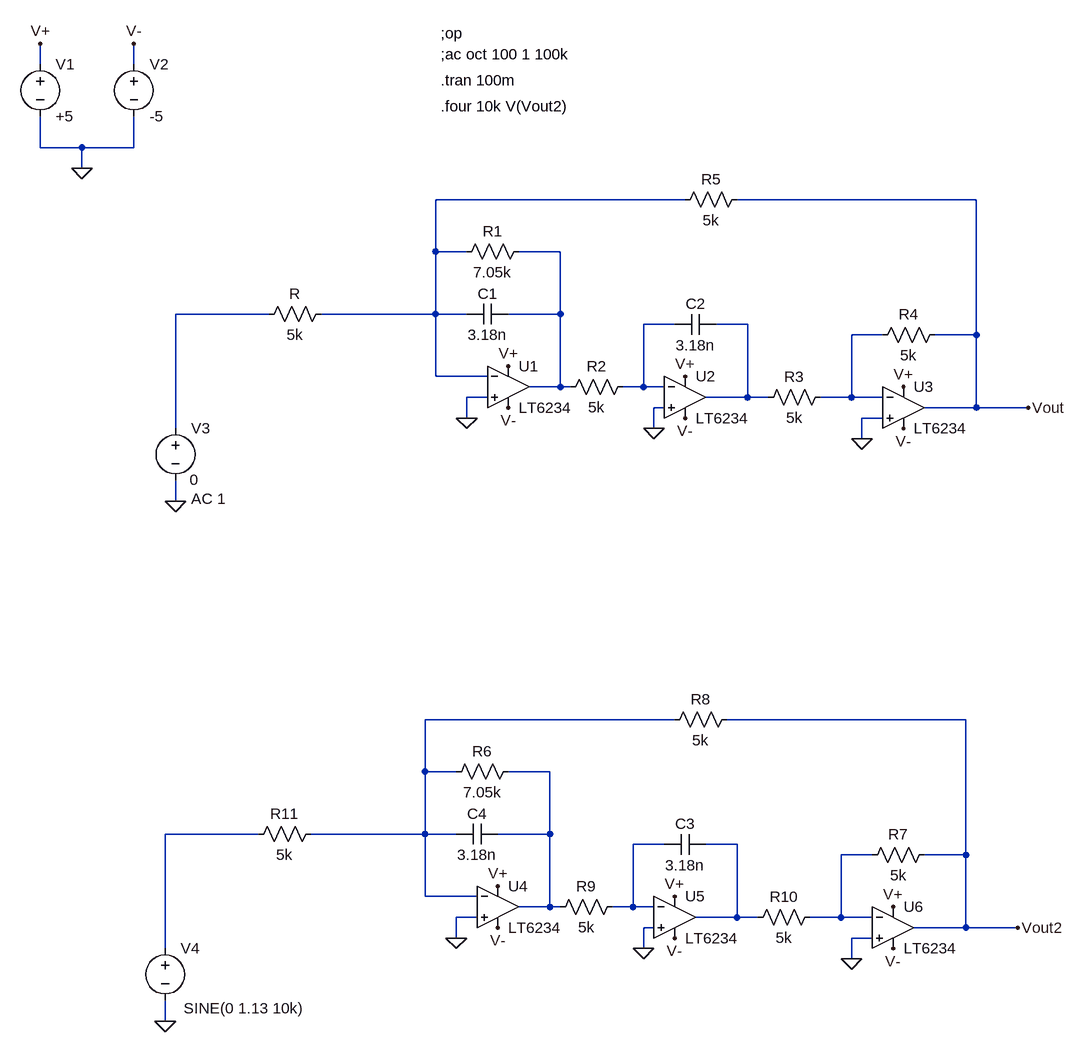
[diagram p0: schematic ETAJUL2_TOW_THOMAS.asc]
ETAJUL2_TOW_THOMAS.asc, the LTspice schematic file:
Version 4
SHEET 1 952 1140
WIRE -640 -352 -640 -384
WIRE -496 -352 -496 -384
WIRE -640 -224 -640 -272
WIRE -576 -224 -640 -224
WIRE -496 -224 -496 -272
WIRE -496 -224 -576 -224
WIRE -576 -192 -576 -224
WIRE 352 -144 -32 -144
WIRE 800 -144 432 -144
WIRE -32 -64 -32 -144
WIRE 16 -64 -32 -64
WIRE 160 -64 96 -64
WIRE -288 32 -432 32
WIRE -32 32 -32 -64
WIRE -32 32 -208 32
WIRE 16 32 -32 32
WIRE 160 32 160 -64
WIRE 160 32 80 32
WIRE 336 48 288 48
WIRE 448 48 400 48
WIRE 656 64 608 64
WIRE 800 64 800 -144
WIRE 800 64 736 64
WIRE -32 128 -32 32
WIRE 48 128 -32 128
WIRE 160 144 160 32
WIRE 160 144 112 144
WIRE 176 144 160 144
WIRE 288 144 288 48
WIRE 288 144 256 144
WIRE 320 144 288 144
WIRE 48 160 16 160
WIRE 448 160 448 48
WIRE 448 160 384 160
WIRE 480 160 448 160
WIRE 608 160 608 64
WIRE 608 160 560 160
WIRE 656 160 608 160
WIRE 320 176 304 176
WIRE 800 176 800 64
WIRE 800 176 720 176
WIRE 880 176 800 176
WIRE 16 192 16 160
WIRE 656 192 624 192
WIRE -432 208 -432 32
WIRE 304 208 304 176
WIRE 624 224 624 192
WIRE -432 320 -432 288
WIRE 336 656 -48 656
WIRE 784 656 416 656
WIRE -48 736 -48 656
WIRE 0 736 -48 736
WIRE 144 736 80 736
WIRE -304 832 -448 832
WIRE -48 832 -48 736
WIRE -48 832 -224 832
WIRE 0 832 -48 832
WIRE 144 832 144 736
WIRE 144 832 64 832
WIRE 320 848 272 848
WIRE 432 848 384 848
WIRE 640 864 592 864
WIRE 784 864 784 656
WIRE 784 864 720 864
WIRE -48 928 -48 832
WIRE 32 928 -48 928
WIRE 144 944 144 832
WIRE 144 944 96 944
WIRE 160 944 144 944
WIRE 272 944 272 848
WIRE 272 944 240 944
WIRE 304 944 272 944
WIRE 32 960 0 960
WIRE 432 960 432 848
WIRE 432 960 368 960
WIRE 464 960 432 960
WIRE 592 960 592 864
WIRE 592 960 544 960
WIRE 640 960 592 960
WIRE 304 976 288 976
WIRE 784 976 784 864
WIRE 784 976 704 976
WIRE 864 976 784 976
WIRE 0 992 0 960
WIRE 640 992 608 992
WIRE -448 1008 -448 832
WIRE 288 1008 288 976
WIRE 608 1024 608 992
WIRE -448 1120 -448 1088
FLAG 16 192 0
FLAG 304 208 0
FLAG 624 224 0
FLAG -576 -192 0
FLAG -640 -384 V+
FLAG 80 112 V+
FLAG 352 128 V+
FLAG 688 144 V+
FLAG 80 176 V-
FLAG 352 192 V-
FLAG 688 208 V-
FLAG -496 -384 V-
FLAG -432 320 0
FLAG 880 176 Vout
FLAG 0 992 0
FLAG 288 1008 0
FLAG 608 1024 0
FLAG 64 912 V+
FLAG 336 928 V+
FLAG 672 944 V+
FLAG 64 976 V-
FLAG 336 992 V-
FLAG 672 1008 V-
FLAG -448 1120 0
FLAG 864 976 Vout2
DATAFLAG 848 176 ""
SYMBOL OpAmps\\LT6234 80 144 R0
SYMATTR InstName U1
SYMBOL OpAmps\\LT6234 352 160 R0
SYMATTR InstName U2
SYMBOL OpAmps\\LT6234 688 176 R0
SYMATTR InstName U3
SYMBOL cap 400 32 R90
WINDOW 0 0 32 VBottom 2
WINDOW 3 32 32 VTop 2
SYMATTR InstName C2
SYMATTR Value 3.18n
SYMBOL cap 80 16 R90
WINDOW 0 0 32 VBottom 2
WINDOW 3 32 32 VTop 2
SYMATTR InstName C1
SYMATTR Value 3.18n
SYMBOL res 112 -80 R90
WINDOW 0 0 56 VBottom 2
WINDOW 3 32 56 VTop 2
SYMATTR InstName R1
SYMATTR Value 7.05k
SYMBOL res 752 48 R90
WINDOW 0 0 56 VBottom 2
WINDOW 3 32 56 VTop 2
SYMATTR InstName R4
SYMATTR Value 5k
SYMBOL res 448 -160 R90
WINDOW 0 0 56 VBottom 2
WINDOW 3 32 56 VTop 2
SYMATTR InstName R5
SYMATTR Value 5k
SYMBOL res 272 128 R90
WINDOW 0 0 56 VBottom 2
WINDOW 3 32 56 VTop 2
SYMATTR InstName R2
SYMATTR Value 5k
SYMBOL res 576 144 R90
WINDOW 0 0 56 VBottom 2
WINDOW 3 32 56 VTop 2
SYMATTR InstName R3
SYMATTR Value 5k
SYMBOL voltage -640 -368 R0
SYMATTR InstName V1
SYMATTR Value +5
SYMBOL voltage -496 -368 R0
SYMATTR InstName V2
SYMATTR Value -5
SYMBOL voltage -432 192 R0
WINDOW 123 24 124 Left 2
WINDOW 39 0 0 Left 0
WINDOW 3 22 95 Left 2
SYMATTR Value2 AC 1
SYMATTR InstName V3
SYMATTR Value 0
SYMBOL res -192 16 R90
WINDOW 0 0 56 VBottom 2
WINDOW 3 32 56 VTop 2
SYMATTR InstName R
SYMATTR Value 5k
SYMBOL OpAmps\\LT6234 64 944 R0
SYMATTR InstName U4
SYMBOL OpAmps\\LT6234 336 960 R0
SYMATTR InstName U5
SYMBOL OpAmps\\LT6234 672 976 R0
SYMATTR InstName U6
SYMBOL cap 384 832 R90
WINDOW 0 0 32 VBottom 2
WINDOW 3 32 32 VTop 2
SYMATTR InstName C3
SYMATTR Value 3.18n
SYMBOL cap 64 816 R90
WINDOW 0 0 32 VBottom 2
WINDOW 3 32 32 VTop 2
SYMATTR InstName C4
SYMATTR Value 3.18n
SYMBOL res 96 720 R90
WINDOW 0 0 56 VBottom 2
WINDOW 3 32 56 VTop 2
SYMATTR InstName R6
SYMATTR Value 7.05k
SYMBOL res 736 848 R90
WINDOW 0 0 56 VBottom 2
WINDOW 3 32 56 VTop 2
SYMATTR InstName R7
SYMATTR Value 5k
SYMBOL res 432 640 R90
WINDOW 0 0 56 VBottom 2
WINDOW 3 32 56 VTop 2
SYMATTR InstName R8
SYMATTR Value 5k
SYMBOL res 256 928 R90
WINDOW 0 0 56 VBottom 2
WINDOW 3 32 56 VTop 2
SYMATTR InstName R9
SYMATTR Value 5k
SYMBOL res 560 944 R90
WINDOW 0 0 56 VBottom 2
WINDOW 3 32 56 VTop 2
SYMATTR InstName R10
SYMATTR Value 5k
SYMBOL voltage -448 992 R0
WINDOW 123 24 124 Left 2
WINDOW 39 0 0 Left 0
WINDOW 3 29 108 Left 2
SYMATTR Value SINE(0 1.13 10k)
SYMATTR InstName V4
SYMBOL res -208 816 R90
WINDOW 0 0 56 VBottom 2
WINDOW 3 32 56 VTop 2
SYMATTR InstName R11
SYMATTR Value 5k
TEXT -24 -368 Left 2 !;ac oct 100 1 100k
TEXT -24 -400 Left 2 !;op
TEXT -24 -328 Left 2 !.tran 100m
TEXT -24 -288 Left 2 !.four 10k V(Vout2)

The netlist it stands for:
* ETAJUL2_TOW_THOMAS.asc
* U1: LT6234 (symbol OpAmps\LT6234 not available, pins judged from their places): In+=0 In-=N001 V+=V+ V-=V- OUT=N002
* U2: LT6234 (symbol OpAmps\LT6234 not available, pins judged from their places): In+=0 In-=N004 V+=V+ V-=V- OUT=N005
* U3: LT6234 (symbol OpAmps\LT6234 not available, pins judged from their places): In+=0 In-=N006 V+=V+ V-=V- OUT=Vout
C2 N005 N004 3.18n
C1 N002 N001 3.18n
R1 N002 N001 7.05k
R4 Vout N006 5k
R5 Vout N001 5k
R2 N004 N002 5k
R3 N006 N005 5k
V1 V+ 0 +5
V2 V- 0 -5
V3 N003 0 0 AC 1
R N001 N003 5k
* U4: LT6234 (symbol OpAmps\LT6234 not available, pins judged from their places): In+=0 In-=N007 V+=V+ V-=V- OUT=N008
* U5: LT6234 (symbol OpAmps\LT6234 not available, pins judged from their places): In+=0 In-=N010 V+=V+ V-=V- OUT=N011
* U6: LT6234 (symbol OpAmps\LT6234 not available, pins judged from their places): In+=0 In-=N012 V+=V+ V-=V- OUT=Vout2
C3 N011 N010 3.18n
C4 N008 N007 3.18n
R6 N008 N007 7.05k
R7 Vout2 N012 5k
R8 Vout2 N007 5k
R9 N010 N008 5k
R10 N012 N011 5k
V4 N009 0 SINE(0 1.13 10k)
R11 N007 N009 5k
;ac oct 100 1 100k
;op
.tran 100m
.four 10k V(Vout2)
.backanno
.end